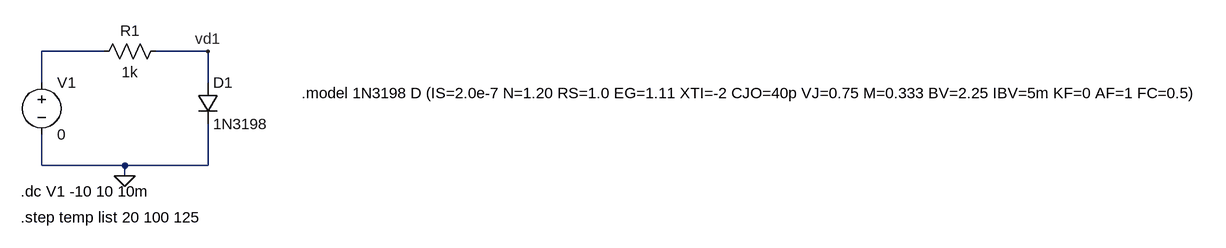
[diagram p0: schematic temperatura.asc]
temperatura.asc, the LTspice schematic file:
Version 4.1
SHEET 1 1892 680
WIRE 80 64 -16 64
WIRE 240 64 160 64
WIRE -16 112 -16 64
WIRE 240 112 240 64
WIRE -16 240 -16 192
WIRE 112 240 -16 240
WIRE 240 240 240 176
WIRE 240 240 112 240
WIRE 112 256 112 240
FLAG 112 256 0
FLAG 240 64 vd1
SYMBOL voltage -16 96 R0
WINDOW 123 0 0 Left 0
WINDOW 39 0 0 Left 0
SYMATTR InstName V1
SYMATTR Value 0
SYMBOL diode 224 112 R0
SYMATTR InstName D1
SYMATTR Value 1N3198
SYMBOL res 176 48 R90
WINDOW 0 0 56 VBottom 2
WINDOW 3 32 56 VTop 2
SYMATTR InstName R1
SYMATTR Value 1k
TEXT -48 280 Left 2 !.dc V1 -10 10 10m
TEXT 384 128 Left 2 !.model 1N3198 D (IS=2.0e-7 N=1.20 RS=1.0 EG=1.11 XTI=-2 CJO=40p VJ=0.75 M=0.333 BV=2.25 IBV=5m KF=0 AF=1 FC=0.5)
TEXT -48 320 Left 2 !.step temp list 20 100 125

The netlist it stands for:
* temperatura.asc
V1 N001 0 0
D1 vd1 0 1N3198
R1 vd1 N001 1k
.model D D
.lib standard.dio
.dc V1 -10 10 10m
.model 1N3198 D (IS=2.0e-7 N=1.20 RS=1.0 EG=1.11 XTI=-2 CJO=40p VJ=0.75 M=0.333 BV=2.25 IBV=5m KF=0 AF=1 FC=0.5)
.step temp list 20 100 125
.backanno
.end